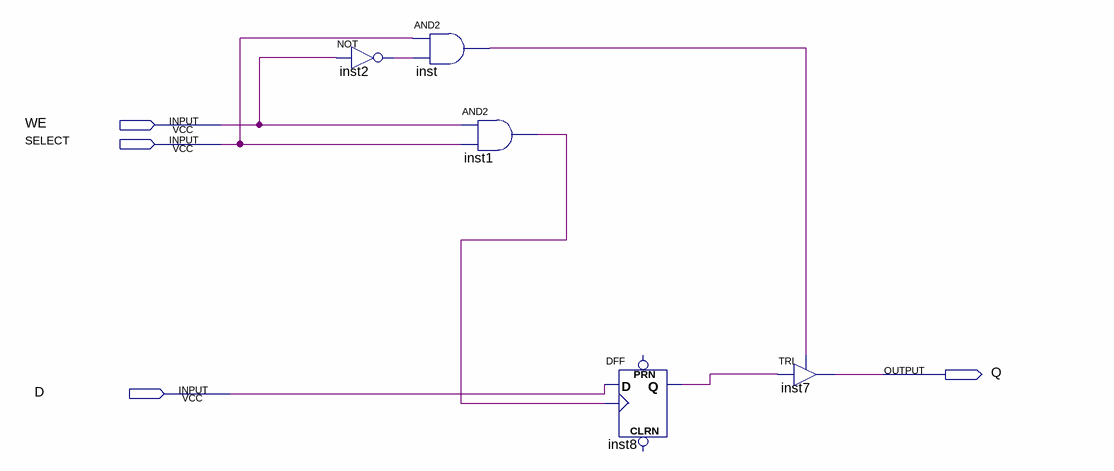
[diagram p0: schematic sheet]
// Quartus schematic CelulaRam.bdf as structural Verilog: 5 symbols, 4 pins
module CelulaRam (
  input  WE,
  input  SELECT,
  input  D,
  output Q
);

  wire inst1_out, inst2_out, inst8_q, inst_out;

  not inst2 (inst2_out, WE);
  and inst (inst_out, SELECT, inst2_out);
  and inst1 (inst1_out, WE, SELECT);
  DFF inst8 (.CLK(inst1_out), .D(D), .Q(inst8_q));  // open: CLRN, PRN
  TRI inst7 (.IN(inst8_q), .OE(inst_out), .OUT(Q));
endmodule
